# Altium schematic sheet relay_matrix.SchDoc: Relay matrix board 12x12
size A3; PageSetup: Record=PageOptions|CenterHorizontal=True|CenterVertical=True|PrintScale=1.00|XCorrection=1.00|YCorrection=1.00|PrintKind=1|BorderSize=5000000|LeftOffset=0|BottomOffset=0|Orientation=2|PaperLength=1000|PaperWidth=1000|Scale=100|PaperSource=7|PrintQuality=-4|MediaType=1|DitherType=10|PaperKind=A3|PrintScaleMode=1
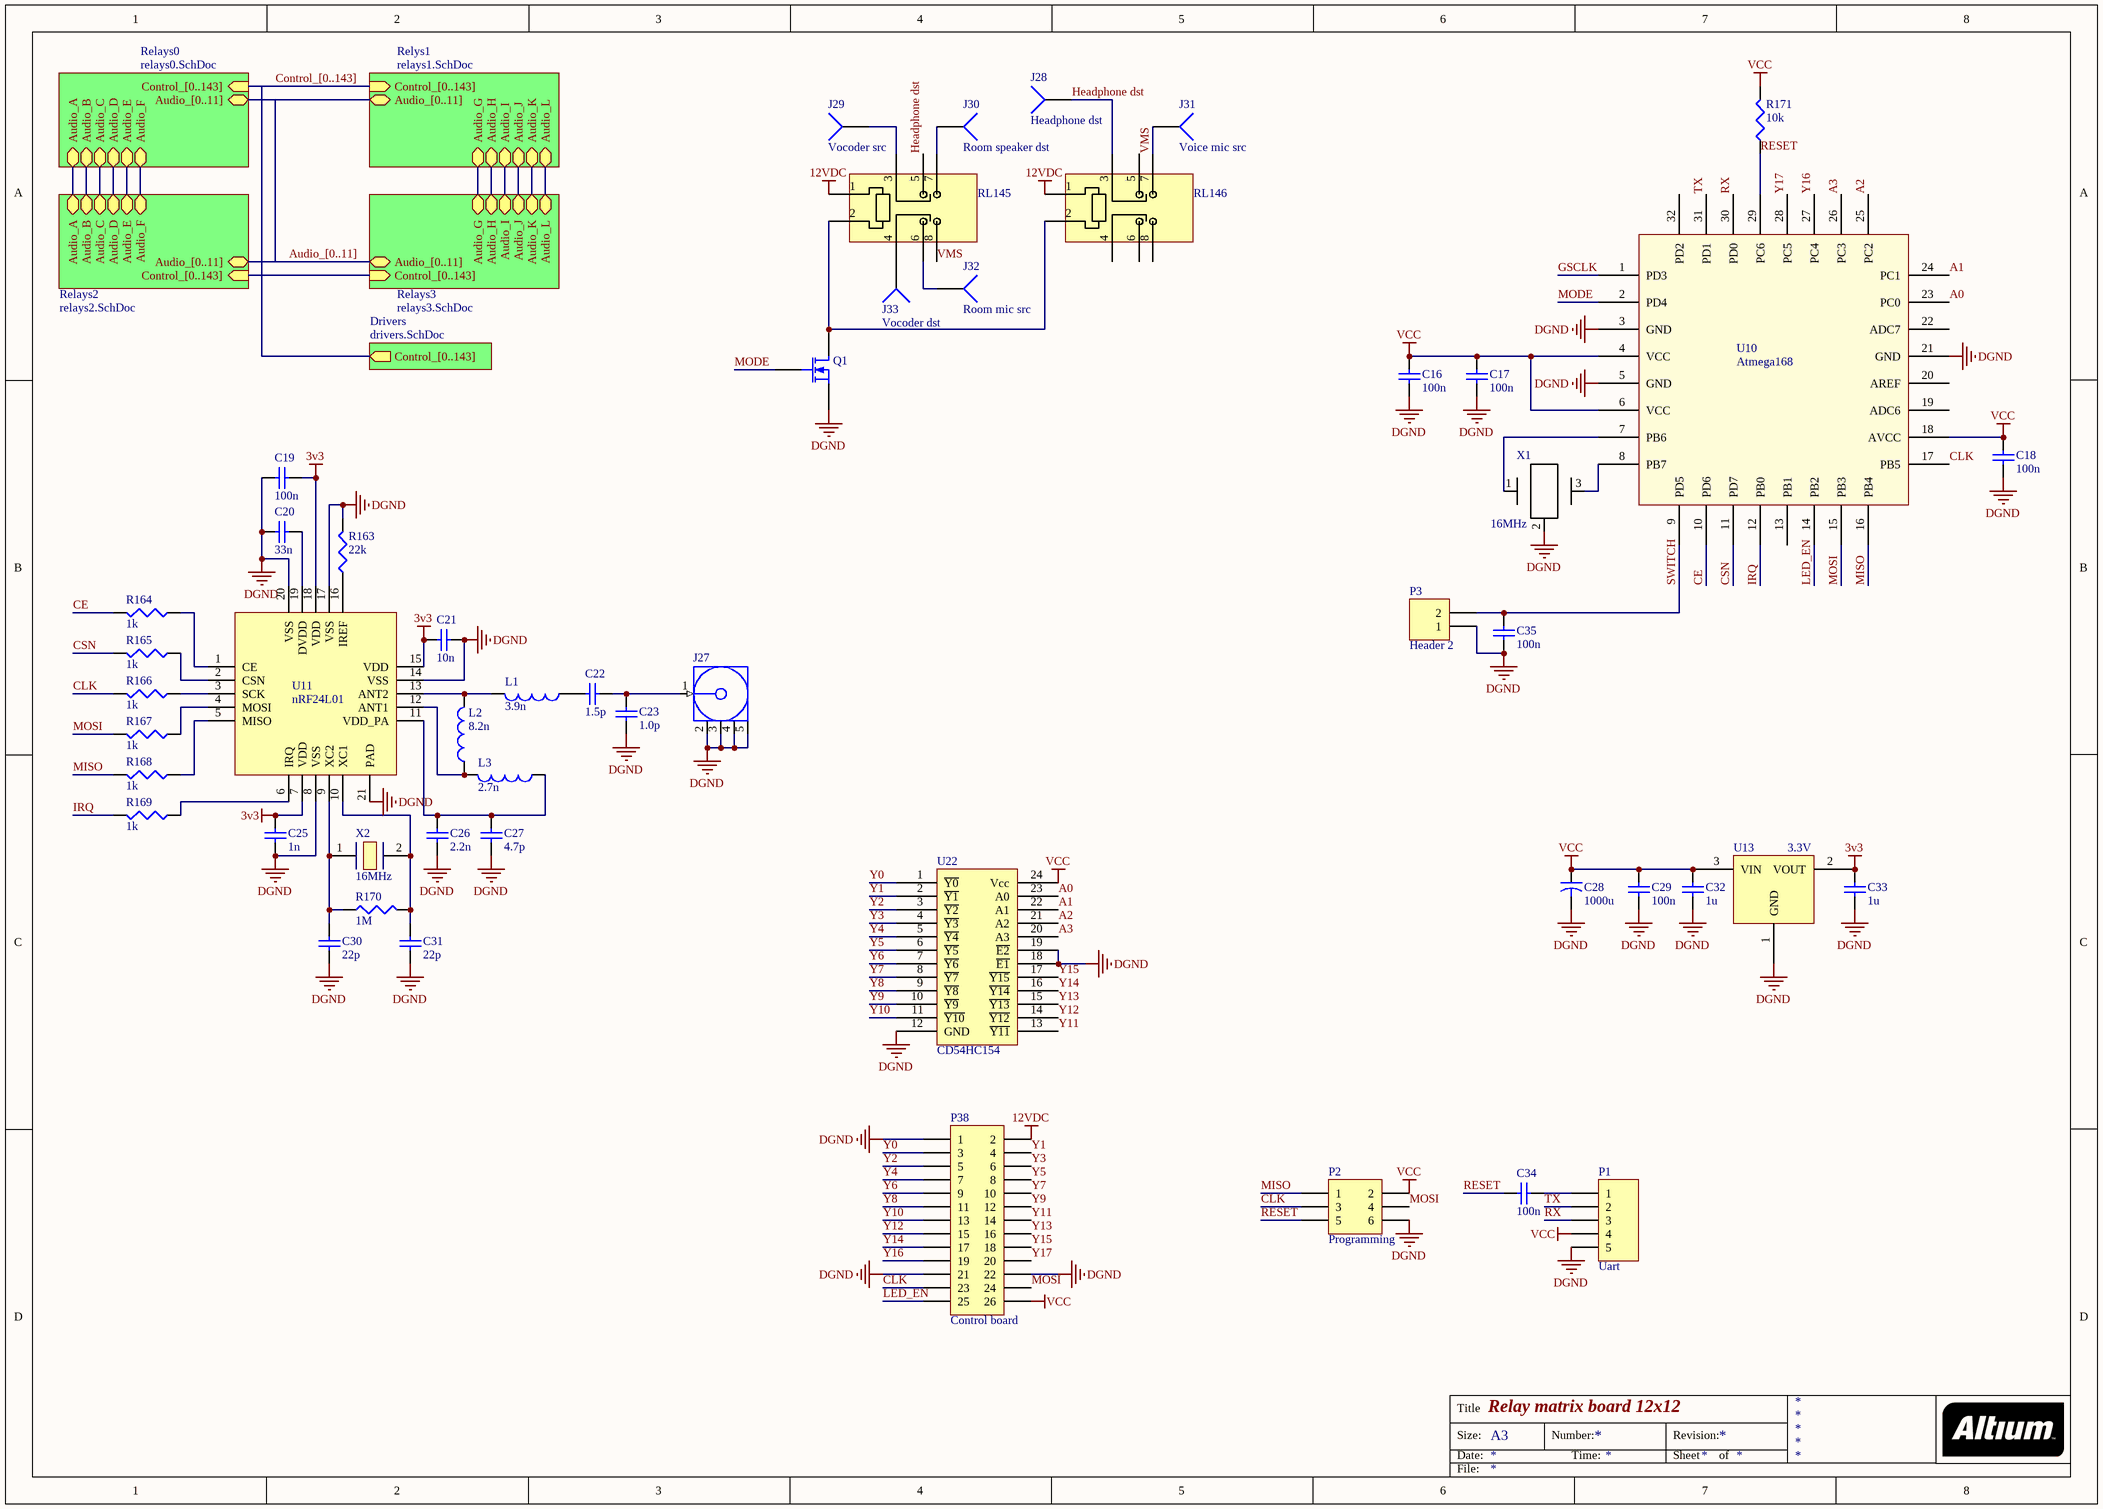
[diagram p0: relay_matrix.SchDoc]

## Parts
C16  value 100n  [1608[0603]]  (hidden comment: Cap Semi)
C17  value 100n  [1608[0603]]  (hidden comment: Cap Semi)
C18  value 100n  [1608[0603]]  (hidden comment: Cap Semi)
C19  value 100n  [1608[0603]]  (hidden comment: Cap Semi)
C20  value 33n  [1608[0603]]  (hidden comment: Cap Semi)
C21  value 10n  [1608[0603]]  (hidden comment: Cap Semi)
C22  value 1.5p  [1608[0603]]  (hidden comment: Cap Semi)
C23  value 1.0p  [1608[0603]]  (hidden comment: Cap Semi)
C25  value 1n  [1608[0603]]  (hidden comment: Cap Semi)
C26  value 2.2n  [1608[0603]]  (hidden comment: Cap Semi)
C27  value 4.7p  [1608[0603]]  (hidden comment: Cap Semi)
C28  value 1000u  [Cap_10x16mm]  (hidden comment: Cap2)
C29  value 100n  [1608[0603]]  (hidden comment: Cap Semi)
C30  value 22p  [1608[0603]]  (hidden comment: Cap Semi)
C31  value 22p  [1608[0603]]  (hidden comment: Cap Semi)
C32  value 1u  [1608[0603]]  (hidden comment: Cap Semi)
C33  value 1u  [1608[0603]]  (hidden comment: Cap Semi)
C34  value 100n  [1608[0603]]  (hidden comment: Cap Semi)
C35  value 100n  [1608[0603]]  (hidden comment: Cap Semi)
J27  COAX-F  [MCX5.08-H5]  (value not drawn)
J28  Headphone dst  [Conn_1_2x4]
J29  Vocoder src  [Conn_1_2x4]
J30  Room speaker dst  [Conn_1_2x4]
J31  Voice mic src  [Conn_1_2x4]
J32  Room mic src  [Conn_1_2x4]
J33  Vocoder dst  [Conn_1_2x4]
L1  value 3.9n  [1608[0603]]  (hidden comment: Inductor)
L2  value 8.2n  [1608[0603]]  (hidden comment: Inductor)
L3  value 2.7n  [1608[0603]]  (hidden comment: Inductor)
P1  Uart  [HDR1X5]
P2  Programming  [HDR2X3H]
P3  Header 2  [HDR1X2]
P38  Control board  [HDR2X13]
Q1  MOSFET-N  [SOT23_M]  (value not drawn)
R163  value 22k  [J1-0603]  (hidden comment: Res3)
R164  value 1k  [J1-0603]  (hidden comment: Res3)
R165  value 1k  [J1-0603]  (hidden comment: Res3)
R166  value 1k  [J1-0603]  (hidden comment: Res3)
R167  value 1k  [J1-0603]  (hidden comment: Res3)
R168  value 1k  [J1-0603]  (hidden comment: Res3)
R169  value 1k  [J1-0603]  (hidden comment: Res3)
R170  value 1M  [J1-0603]  (hidden comment: Res3)
R171  value 10k  [J1-0603]  (hidden comment: Res3)
RL145  Relay  [Relay_S13]  (value not drawn)
RL146  Relay  [Relay_S13]  (value not drawn)
U10  Atmega168  [TQFP-32]
U11  nRF24L01  [QFN20]
U13  3.3V  [SOT23]
U22  CD54HC154  [SO24]
X1  value 16MHz  [SMD-RESONATOR]  (hidden comment: Resonator)
X2  value 16MHz  [Crystal_7A_series]  (hidden comment: Crystal)

## Sub-sheets
Drivers = drivers.SchDoc: Control_[0..143] (out)
Relays0 = relays0.SchDoc: Audio_A (bidir), Audio_B (bidir), Audio_C (bidir), Audio_D (bidir), Audio_E (bidir), Audio_F (bidir), Audio_[0..11] (bidir), Control_[0..143] (in)
Relays2 = relays2.SchDoc: Audio_A (bidir), Audio_B (bidir), Audio_C (bidir), Audio_D (bidir), Audio_E (bidir), Audio_F (bidir), Audio_[0..11] (bidir), Control_[0..143] (in)
Relays3 = relays3.SchDoc: Audio_G (bidir), Audio_H (bidir), Audio_I (bidir), Audio_J (bidir), Audio_K (bidir), Audio_L (bidir), Audio_[0..11] (bidir), Control_[0..143] (in)
Relys1 = relays1.SchDoc: Audio_G (bidir), Audio_H (bidir), Audio_I (bidir), Audio_J (bidir), Audio_K (bidir), Audio_L (bidir), Audio_[0..11] (bidir), Control_[0..143] (in)

## Nets
3v3: C19.2 C21.1 C25.1 C33.1 U11.7(VDD) U11.15(VDD) U11.18(VDD) U13.2(VOUT)
12VDC: P38.2 RL145.1 RL146.1
DGND: C16.2 C17.2 C18.2 C19.1 C20.1 C21.2 C23.2 C25.2 C26.2 C27.2 C28.2 C29.2 C30.2 C31.2 C32.2 C33.2 C35.2 J27.2(GND) J27.3(GND) J27.4(GND) J27.5(GND) P1.5 P2.6 P3.1 P38.1 P38.21 P38.22 Q1.3(S) R163.2 U10.3(GND) U10.5(GND) U10.21(GND) U11.8(VSS) U11.14(VSS) U11.17(VSS) U11.20(VSS) U11.21(PAD) U13.1(GND) U22.12(GND) U22.18(~{E1}) U22.19(~{E2}) X1.2
VCC: C16.1 C17.1 C18.1 C28.1 C29.1 C32.1 P1.4 P2.2 P38.26 R171.2 U10.4(VCC) U10.6(VCC) U10.18(AVCC) U13.3(VIN) U22.24(Vcc)
A0: U10.23(PC0) U22.23(A0)
A1: U10.24(PC1) U22.22(A1)
A2: U10.25(PC2) U22.21(A2)
A3: U10.26(PC3) U22.20(A3)
CE: R164.2 U10.10(PD6)
CLK: P2.3 P38.23 R166.2 U10.17(PB5)
CSN: R165.2 U10.11(PD7)
GSCLK: U10.1(PD3)
Headphone dst: J28.1 RL145.5 RL146.3
IRQ: R169.2 U10.12(PB0)
LED_EN: P38.25 U10.14(PB2)
MISO: P2.1 R168.2 U10.16(PB4)
MODE: Q1.2(G) U10.2(PD4)
MOSI: P2.4 P38.24 R167.2 U10.15(PB3)
RESET: C34.1 P2.5 R171.1 U10.29(PC6)
RX: P1.3 U10.30(PD0)
SWITCH: C35.1 P3.2 U10.9(PD5)
TX: P1.2 U10.31(PD1)
VMS: J31.1 RL145.8 RL146.7
Y0: P38.3 U22.1(~{Y0})
Y1: P38.4 U22.2(~{Y1})
Y2: P38.5 U22.3(~{Y2})
Y3: P38.6 U22.4(~{Y3})
Y4: P38.7 U22.5(~{Y4})
Y5: P38.8 U22.6(~{Y5})
Y6: P38.9 U22.7(~{Y6})
Y7: P38.10 U22.8(~{Y7})
Y8: P38.11 U22.9(~{Y8})
Y9: P38.12 U22.10(~{Y9})
Y10: P38.13 U22.11(~{Y10})
Y11: P38.14 U22.13(~{Y11})
Y12: P38.15 U22.14(~{Y12})
Y13: P38.16 U22.15(~{Y13})
Y14: P38.17 U22.16(~{Y14})
Y15: P38.18 U22.17(~{Y15})
Y16: P38.19 U10.27(PC4)
Y17: P38.20 U10.28(PC5)
NetC20_2: C20.2 U11.19(DVDD)
NetC22_1: C22.1 L1.1
NetC22_2: C22.2 C23.1 J27.1(Signal)
NetC26_1: C26.1 C27.1 L3.1 U11.11(VDD_PA)
NetC30_1: C30.1 R170.1 U11.9(XC2) X2.1
NetC31_1: C31.1 R170.2 U11.10(XC1) X2.2
NetC34_2: C34.2 P1.1
NetJ29_1: J29.1 RL145.3
NetJ30_1: J30.1 RL145.7
NetJ32_1: J32.1 RL145.6
NetJ33_1: J33.1 RL145.4
NetL1_2: L1.2 L2.2 U11.13(ANT2)
NetL2_1: L2.1 L3.2 U11.12(ANT1)
NetQ1_1: Q1.1(D) RL145.2 RL146.2
NetR163_1: R163.1 U11.16(IREF)
NetR164_1: R164.1 U11.1(CE)
NetR165_1: R165.1 U11.2(CSN)
NetR166_1: R166.1 U11.3(SCK)
NetR167_1: R167.1 U11.4(MOSI)
NetR168_1: R168.1 U11.5(MISO)
NetR169_1: R169.1 U11.6(IRQ)
NetU10_7: U10.7(PB6) X1.1
NetU10_8: U10.8(PB7) X1.3
(unnamed): sheet Relays0/Audio_A, sheet Relays2/Audio_A
(unnamed): sheet Relays0/Audio_B, sheet Relays2/Audio_B
(unnamed): sheet Relays0/Audio_C, sheet Relays2/Audio_C
(unnamed): sheet Relays0/Audio_D, sheet Relays2/Audio_D
(unnamed): sheet Relays0/Audio_E, sheet Relays2/Audio_E
(unnamed): sheet Relays0/Audio_F, sheet Relays2/Audio_F
(unnamed): sheet Relys1/Audio_G, sheet Relays3/Audio_G
(unnamed): sheet Relys1/Audio_H, sheet Relays3/Audio_H
(unnamed): sheet Relys1/Audio_I, sheet Relays3/Audio_I
(unnamed): sheet Relys1/Audio_J, sheet Relays3/Audio_J
(unnamed): sheet Relys1/Audio_K, sheet Relays3/Audio_K
(unnamed): sheet Relys1/Audio_L, sheet Relays3/Audio_L

Not connected (* = marked no-connect by the designer): RL146 4 5 6 8; U10 13(PB1) 19(ADC6) 20(AREF) 22(ADC7) 32(PD2)

## Buses and harness runs
bus Audio_[0..11] = sheet Relays0/Audio_[0..11] = sheet Relays2/Audio_[0..11] = sheet Relays3/Audio_[0..11] = sheet Relys1/Audio_[0..11]
bus Control_[0..143] = sheet Drivers/Control_[0..143] = sheet Relays0/Control_[0..143] = sheet Relays2/Control_[0..143] = sheet Relays3/Control_[0..143] = sheet Relys1/Control_[0..143]

## Notes on the sheet
- Title
- Size:
- Date:
- A3
- Number:
- Time:
- Revision:
- Sheet
- of
- File:

## Library data of the parts
C16-C23 C25-C27 C29-C35 = Cap Semi: Capacitor (Semiconductor SIM Model); Published: 8-Jun-2000; LatestRevisionDate: 29-May-2009; LatestRevisionNote: IPC-7351 Footprint Added.; PackageReference: C1206; Publisher: Altium Limited; PackageDescription: Chip Capacitor
C28 = Cap2: Capacitor; Published: 23-Sep-2002; PackageReference: CAPR5-4X5; Publisher: Altium Limited; PackageDescription: Capacitor; 2 Leads
J27 = COAX-F: RF Coaxial PCB Connector, MCX; Thru-Hole, Right-Angle Mount Socket, Blunt Post Terminal, 50 Ohm Impedance; PCB_Layout: Complies with manufacturer's recommendation.; DrillSize: Corresponds to nominal value.; Published: 15-Jul-2004; LatestRevisionDate: 15-Jul-2004; LatestRevisionNote: Component Replaced.; DatasheetDocument: 30-May-2003; PackageDocument: 04-Jul-1999; PackageReference: 919-119J-51AX; Publisher: Altium Limited; ComponentLink1Description: Manufacturer Link; ComponentLink1URL: http://www.amphenolrf.com/
J28-J33 = Socket: LatestRevisionDate: 17-Jul-2002; LatestRevisionNote: Re-released for DXP Platform.; Publisher: Altium Limited
L1-L3 = Inductor: Code_IEC: 1005; Published: 8-Jun-2000; LatestRevisionDate: 29-May-2009; LatestRevisionNote: IPC-7351 Footprint Added.; PackageReference: 0402-A; Publisher: Altium Limited; PackageDescription: Chip Inductor; Code_JEITA: 0402
P1 = Header 5: Header, 5-Pin; LatestRevisionDate: 17-Jul-2002; LatestRevisionNote: Re-released for DXP Platform.; Publisher: Altium Limited
P2 = Header 3X2H: Header, 3-Pin, Dual row, Right Angle; LatestRevisionDate: 17-Jul-2002; LatestRevisionNote: Re-released for DXP Platform.; Publisher: Altium Limited
P3 = Header 2: Header, 2-Pin; LatestRevisionDate: 17-Jul-2002; LatestRevisionNote: Re-released for DXP Platform.; Publisher: Altium Limited
P38 = Header 13X2: Header, 13-Pin, Dual row; LatestRevisionDate: 17-Jul-2002; LatestRevisionNote: Re-released for DXP Platform.; Publisher: Altium Limited
Q1 = MOSFET-N: N-Channel MOSFET; pin to pad: 2>3 3>2; Published: 8-Jun-2000; LatestRevisionDate: 17-Jul-2002; LatestRevisionNote: Re-released for DXP Platform.; PackageVersion: 1995/1996; PackageReference: E3; Publisher: Altium Limited; PackageDescription: TO, Flat Index; 3 In-Line, Axial Leads; Body Dia. 4.6mm; Lead Dia. 0.5 mm (max)
R163-R171 = Res3: Resistor; Published: 8-Jun-2000; LatestRevisionDate: 29-May-2009; LatestRevisionNote: IPC-7351 Footprint Added.; PackageReference: J1-0603; Publisher: Altium Limited; PackageDescription: Chip Resistor
RL145 RL146 = Relay_S13: Miniature power relay; Part number: S13-12V-2C
U11 = nRF24L01: Single Chip 2.4GHz Transciever; Part number: *
U13 = Voltage_regulator_3pin: Fixed voltage regulator; Part number: 2363085
U22 = CD54HC154: High speed logic 4 to 16 decoder; Part number: 2407121
X2 = Crystal: Part Number: *